# EAGLE design YBDuino (EAGLE 6.5.0)
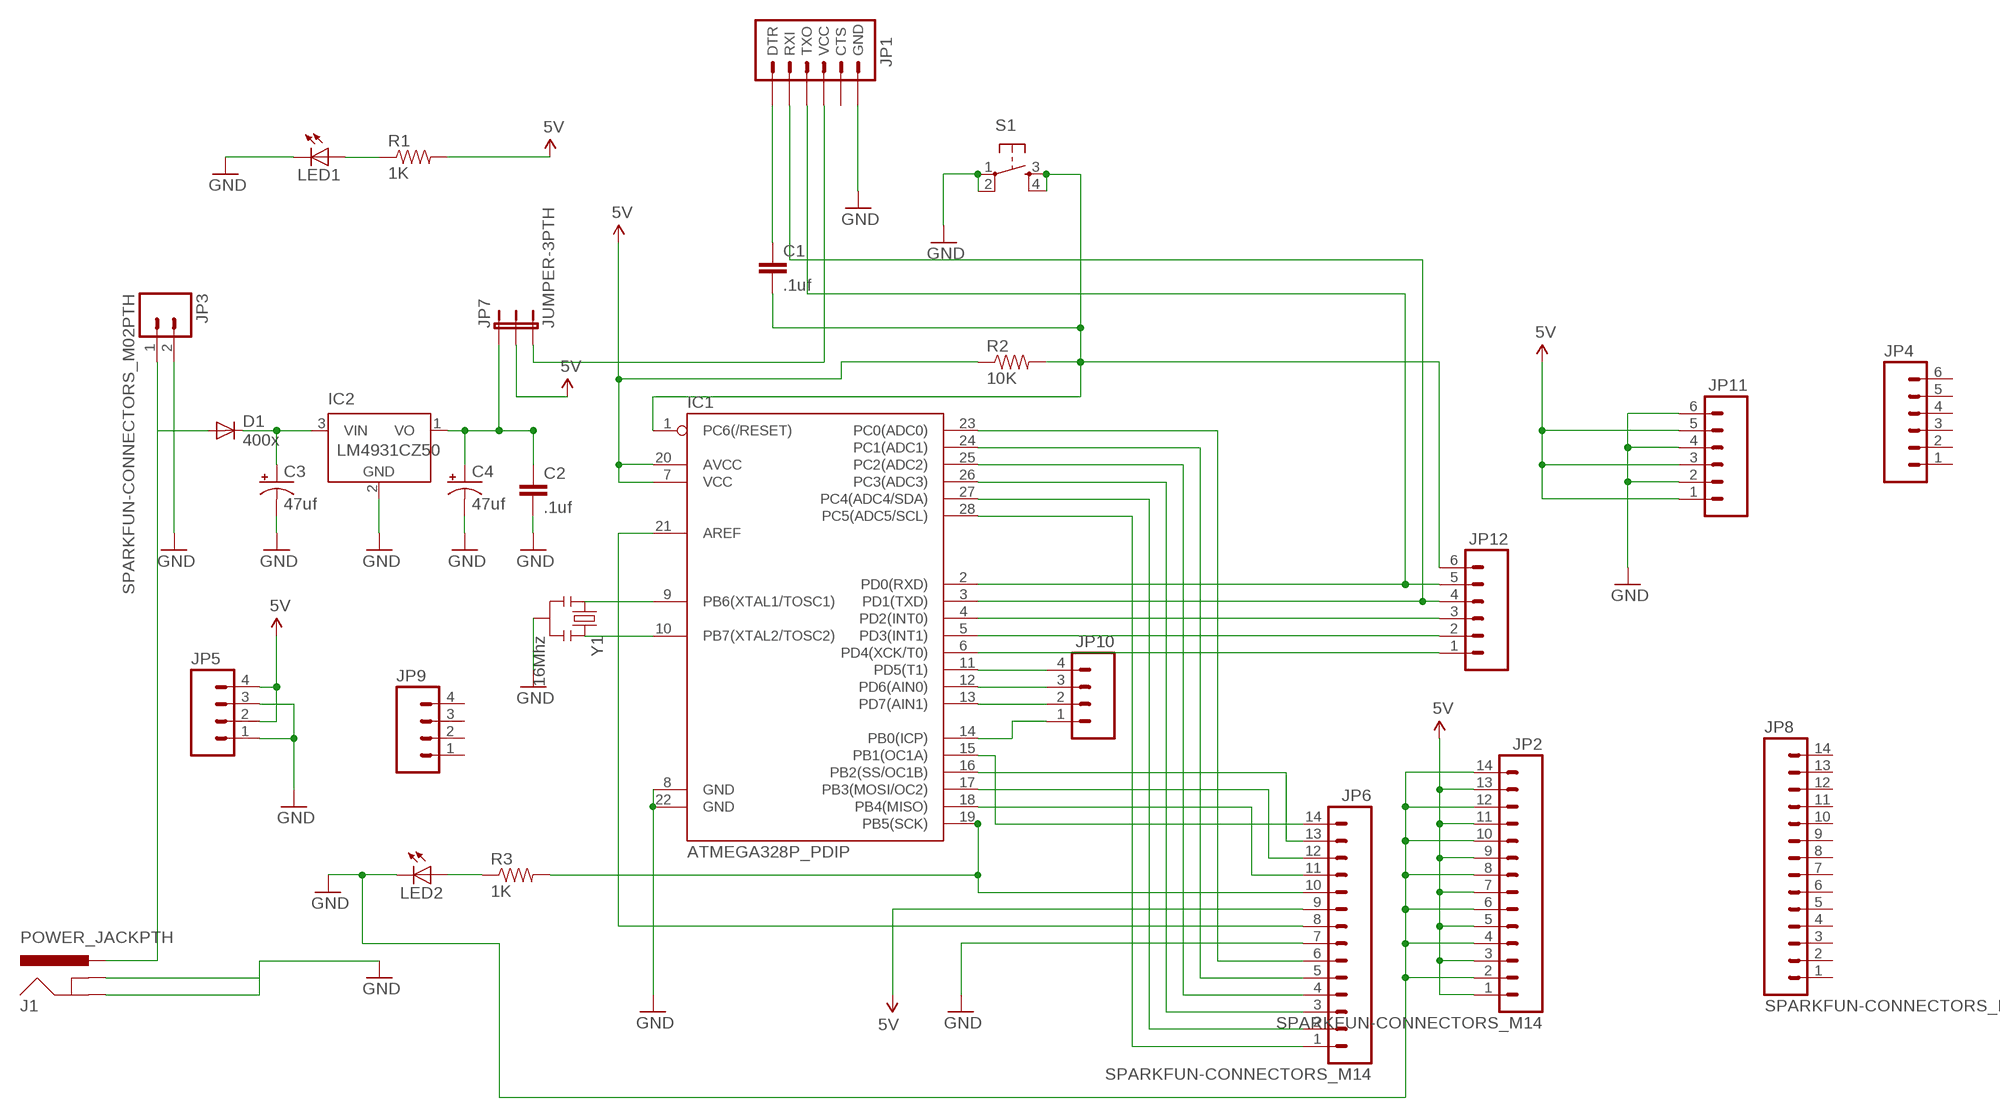
[diagram p0: schematic, sheet 1]

## Parts
C1  .1uf  CAPPTH  [CAP-PTH-SMALL]
C2  .1uf  CAPPTH  [CAP-PTH-SMALL]
C3  47uf  CAP_POLPTH1  [CPOL-RADIAL-100UF-25V]
C4  47uf  CAP_POLPTH1  [CPOL-RADIAL-100UF-25V]
D1  400x  DIODE-C1702-05  [C1702-05]
IC1  ATMEGA328P_PDIP  [DIL28-3]
IC2  LM4931CZ50  LM2936Z-3.0  [TO92]
J1  POWER_JACKPTH  [POWER_JACK_PTH]
JP1  SPARKFUN-CONNECTORS_ARDUINO_SERIAL_PROGRAMPTH-KIT  [SPARKFUN-CONNECTORS_1X06-KIT]
JP2  SPARKFUN-CONNECTORS_M14  [SPARKFUN-CONNECTORS_1X14]
JP3  SPARKFUN-CONNECTORS_M02PTH  [SPARKFUN-CONNECTORS_1X02]
JP4  SPARKFUN-CONNECTORS_M06SIP  [SPARKFUN-CONNECTORS_1X06]
JP5  SPARKFUN-CONNECTORS_M041X04_NO_SILK  [SPARKFUN-CONNECTORS_1X04_NO_SILK]
JP6  SPARKFUN-CONNECTORS_M14  [SPARKFUN-CONNECTORS_1X14]
JP7  JUMPER-3PTH  [1X03]
JP8  SPARKFUN-CONNECTORS_M14  [SPARKFUN-CONNECTORS_1X14]
JP9  SPARKFUN-CONNECTORS_M041X04_NO_SILK  [SPARKFUN-CONNECTORS_1X04_NO_SILK]
JP10  SPARKFUN-CONNECTORS_M041X04_NO_SILK  [SPARKFUN-CONNECTORS_1X04_NO_SILK]
JP11  SPARKFUN-CONNECTORS_M06SIP  [SPARKFUN-CONNECTORS_1X06]
JP12  SPARKFUN-CONNECTORS_M06SIP  [SPARKFUN-CONNECTORS_1X06]
LED1  LED3MM  [LED3MM]
LED2  LED3MM  [LED3MM]
R1  1K  RESISTORPTH-1/4W-VERT  [AXIAL-0.1]
R2  10K  RESISTORPTH-1/4W-VERT  [AXIAL-0.1]
R3  1K  RESISTORPTH-1/4W-VERT  [AXIAL-0.1]
S1  TAC_SWITCHPTH  [TACTILE-PTH]
Y1  16Mhz  RESONATORPTH  [RESONATOR-PTH]

## Nets
5V: IC1.7(VCC) IC1.20(AVCC) JP2.1 JP2.3 JP2.5 JP2.7 JP2.9 JP2.11 JP2.13 JP5.2 JP5.4 JP6.9 JP7.2 JP11.1 JP11.3 JP11.5 R1.P$2 R2.P$1
GND: C2.2 C3.2(-) C4.2(-) IC1.8(GND) IC1.22(GND) IC2.2(GND) J1.GND J1.GNDBREAK JP1.6(GND) JP2.2 JP2.4 JP2.6 JP2.8 JP2.10 JP2.12 JP2.14 JP3.2 JP5.1 JP5.3 JP6.7 JP11.2 JP11.4 JP11.6 LED1.K(C) LED2.K(C) S1.1 S1.2 Y1.2
N$1: IC1.2(PD0(RXD)) JP1.3(TXO) JP12.5
N$2: IC1.3(PD1(TXD)) JP1.2(RXI) JP12.4
N$3: IC1.4(PD2(INT0)) JP12.3
N$4: IC1.5(PD3(INT1)) JP12.2
N$5: IC1.6(PD4(XCK/T0)) JP12.1
N$6: C1.2 IC1.1(PC6(/RESET)) JP12.6 R2.P$2 S1.3 S1.4
N$7: LED1.A R1.P$1
N$8: IC1.11(PD5(T1)) JP10.4
N$9: IC1.12(PD6(AIN0)) JP10.3
N$10: IC1.13(PD7(AIN1)) JP10.2
N$11: IC1.14(PB0(ICP)) JP10.1
N$12: IC1.15(PB1(OC1A)) JP6.14
N$13: IC1.16(PB2(SS/OC1B)) JP6.13
N$14: IC1.17(PB3(MOSI/OC2)) JP6.12
N$15: IC1.18(PB4(MISO)) JP6.11
N$16: IC1.19(PB5(SCK)) JP6.10 R3.P$2
N$17: D1.A J1.PWR JP3.1
N$18: IC1.10(PB7(XTAL2/TOSC2)) Y1.3
N$19: IC1.21(AREF) JP6.8
N$20: IC1.23(PC0(ADC0)) JP6.6
N$21: IC1.24(PC1(ADC1)) JP6.5
N$22: IC1.25(PC2(ADC2)) JP6.4
N$23: IC1.26(PC3(ADC3)) JP6.3
N$24: IC1.9(PB6(XTAL1/TOSC1)) Y1.1
N$25: IC1.28(PC5(ADC5/SCL)) JP6.1
N$26: IC1.27(PC4(ADC4/SDA)) JP6.2
N$28: C3.1(+) D1.C IC2.3(VIN)
N$29: LED2.A R3.P$1
N$30: C1.1 JP1.1(DTR)
N$32: C2.1 C4.1(+) IC2.1(VO) JP7.1
N$33: JP1.4(VCC) JP7.3
Unconnected: JP1.5(CTS) JP4.1 JP4.2 JP4.3 JP4.4 JP4.5 JP4.6 JP8.1 JP8.2 JP8.3 JP8.4 JP8.5 JP8.6 JP8.7 JP8.8 JP8.9 JP8.10 JP8.11 JP8.12 JP8.13 JP8.14 JP9.1 JP9.2 JP9.3 JP9.4

## Library data of the parts
C1 C2 = SparkFun-Capacitors:CAP: Capacitor Standard 0603 ceramic capacitor, and 0.1" leaded capacitor.
C3 C4 = SparkFun-Capacitors:CAP_POL: Capacitor Polarized These are standard SMD and PTH capacitors. Normally 10uF, 47uF, and 100uF in electrolytic and tantalum varieties. Always verify the external diameter of the through hole cap, it varies with capacity, voltage, and manufacturer. The EIA devices should be standard.
D1 = diode:DIODE-: DIODE
IC1 = SparkFun-DigitalIC:ATMEGA328P_PDIP: uC used in the Arduino 32kb flash, 1k EEPROM, 2k SRAM This is the through-hole version of this chip.
IC2 = national-semiconductor:LM2936?*: Ultra-Low Quiescent Current LDO Voltage Regulator Source: Data sheet <http://www.national.com/ds/LM/LM2936.pdf>; MF: NATIONAL SEMICONDUCTOR; MPN: LM2936Z-3.0/NOPB; OC_FARNELL: 1312709; OC_NEWARK: 41K4531
J1 = ybduino:POWER_JACK: Power Jack This is the standard 5.5mm barrel jack for power. The PTH is the most common, proven, reliable, footprint. The Slot footprint only works if the mill layer is transmitted to the PCB fab house so be warned. Mating wall wart : TOL-00298 (and others); PROD_ID: PRT-00119
JP1 = Arduino:SPARKFUN-CONNECTORS_ARDUINO_SERIAL_PROGRAM: FTDI connector footprints
JP2 JP6 JP8 = Arduino:SPARKFUN-CONNECTORS_M14: Header 14 Standard 14-pin 0.1" header. Use with straight break away headers (SKU : PRT-00116), right angle break away headers (PRT-00553), swiss pins (PRT-00743), machine pins (PRT-00117), and female headers (PRT-00115).
JP3 = Arduino:SPARKFUN-CONNECTORS_M02: Standard 2-pin 0.1" header. Use with - straight break away headers ( PRT-00116) - right angle break away headers (PRT-00553) - swiss pins (PRT-00743) - machine pins (PRT-00117) - female headers (PRT-00115) Molex polarized connector foot print use with: PRT-08233 with associated crimp pins and housings. 2.54_SCREWTERM for use with PRT-10571. 3.5mm Screw Terminal footprints for PRT-08084 5mm Screw Terminal footprints for use with PRT-08433
JP4 JP11 JP12 = Arduino:SPARKFUN-CONNECTORS_M06: Header 6 Standard 6-pin 0.1" header. Use with straight break away headers (SKU : PRT-00116), right angle break away headers (PRT-00553), swiss pins (PRT-00743), machine pins (PRT-00117), and female headers (PRT-00115). Molex polarized connector foot print use with SKU : PRT-08094 with associated crimp pins and housings. NOTES ON THE VARIANTS LOCK and LOCK_LONGPADS... This footprint was designed to help hold the alignment of a through-hole component (i.e. 6-pin header) while soldering it into place. You may notice that each hole has been shifted either up or down by 0.005 of an inch from it's more standard position (which is a perfectly straight line). This slight alteration caused the pins (the squares in the middle) to touch the edges of the holes. Because they are alternating, it causes a "brace" to hold the component in place. 0.005 has proven to be the perfect amount of "off-center" position when using our standard breakaway headers. Although looks a little odd when you look at the bare footprint, once you have a header in there, the alteration is very hard to notice. Also,if you push a header all the way into place, it is covered up entirely on the bottom side. This idea of altering the position of holes to aid alignment will be further integrated into the Sparkfun Library for other footprints. It can help hold any component with 3 or more connection pins.
JP5 JP9 JP10 = Arduino:SPARKFUN-CONNECTORS_M04: Header 4 Standard 4-pin 0.1" header. Use with straight break away headers (SKU : PRT-00116), right angle break away headers (PRT-00553), swiss pins (PRT-00743), machine pins (PRT-00117), and female headers (PRT-00115). Molex polarized connector foot print use with SKU : PRT-08231 with associated crimp pins and housings. 1MM SMD Version SKU: PRT-10208
JP7 = SparkFun-Passives:JUMPER-3
LED1 LED2 = SparkFun-LED:LED: LEDs Standard schematic elements and footprints for 5mm, 3mm, 1206, and 0603 sized LEDs. 5mm - Spark Fun Electronics SKU : COM-00529 (and others)
R1-R3 = SparkFun-Resistors:RESISTOR: Resistor Basic schematic elements and footprints for 0603, 1206, and PTH resistors.
S1 = SparkFun-Electromechanical:TAC_SWITCH: Momentary Switch Button commonly used for reset or general input. Spark Fun Electronics SKU : COM-00097 SMT- SWCH-08247
Y1 = SparkFun-FreqCtrl:RESONATOR: Resonator Small SMD resonator. Used, eg, on the Arduino Pro/ Pro Mini boards. 8MHz- XTAL-08895 16MHz- XTAL-08900

## Board
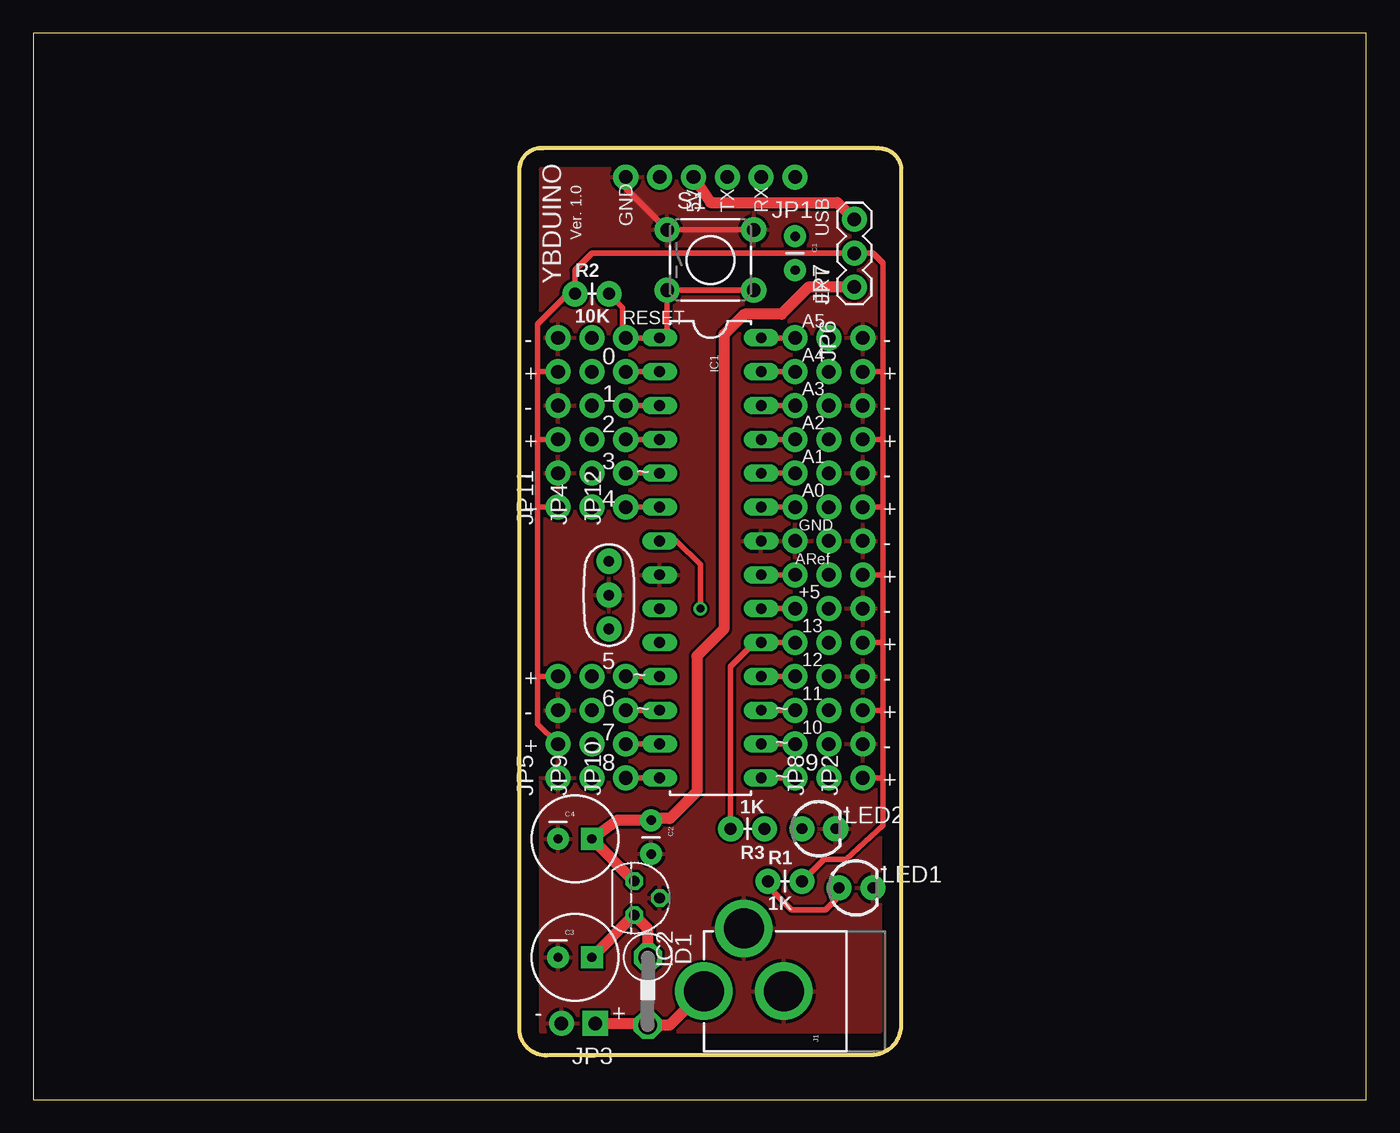
[diagram p1: board, top side]
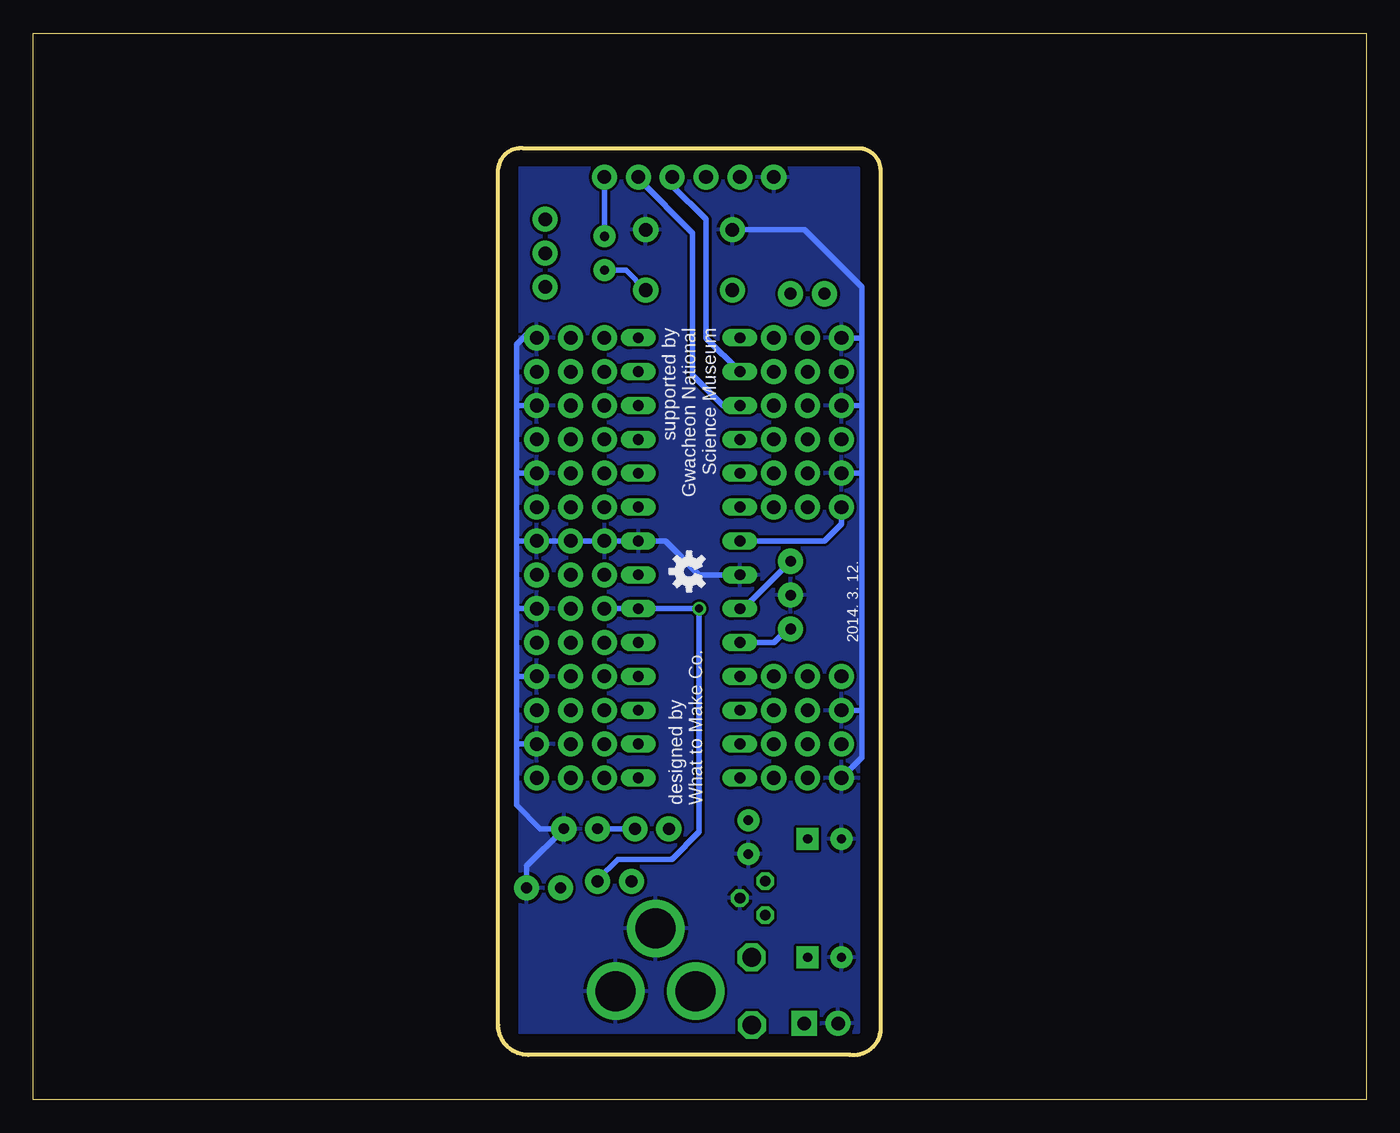
[diagram p2: board, bottom side, seen from below]

Size 100 x 80 mm. Coordinates in mm from the lower left corner, seen from the top.
Outline: 0,0 100,0 100,80 0,80 0,0
Outline: 38.73,3.35 62.87,3.35 arc90 65.13,5.59 65.13,69.85 arc90 63.25,71.37 38.23,71.37 arc90 36.45,69.85 36.45,5.08 arc90 38.73,3.35
Copper layers (1*16): Top 0.035mm / dielectric 1.5mm / Bottom 0.035mm
Design rules "default *": minimum track width 10mil, minimum drill 24mil, track to track 8mil, track to pad 8mil, pad to pad 8mil, via to via 8mil, smd to smd 8mil, copper to edge 40mil, drill to drill 8mil, minimum pad ring 10mil, minimum via ring 8mil, stop-mask expansion 4mil, vias tented up to drill 0mil, thermal gap 10mil

### Footprints (pad centres in the part's own frame; a part is rotated, then mirrored left to right if it is on the bottom)
CAP-PTH-SMALL = drill 0.7 pad 1.651: 1 0,0; 2 2.54,0
CPOL-RADIAL-100UF-25V = drill 0.7 pad 1.651 square: 1 1.27,0 | drill 0.7 pad 1.651: 2 -1.27,0
C1702-05 = drill 1.397 octagon: A 2.54,0; C -2.54,0
DIL28-3 = drill 0.813 long: 1 -16.51,-3.81; 2 -13.97,-3.81; 3 -11.43,-3.81; 4 -8.89,-3.81; 5 -6.35,-3.81; 6 -3.81,-3.81; 7 -1.27,-3.81; 8 1.27,-3.81; 9 3.81,-3.81; 10 6.35,-3.81; 11 8.89,-3.81; 12 11.43,-3.81; 13 13.97,-3.81; 14 16.51,-3.81; 15 16.51,3.81; 16 13.97,3.81; 17 11.43,3.81; 18 8.89,3.81; 19 6.35,3.81; 20 3.81,3.81; 21 1.27,3.81; 22 -1.27,3.81; 23 -3.81,3.81; 24 -6.35,3.81; 25 -8.89,3.81; 26 -11.43,3.81; 27 -13.97,3.81; 28 -16.51,3.81
TO92 = drill 0.813 pad 1.27 octagon: 1 -1.27,0; 2 0,1.905; 3 1.27,0
POWER_JACK_PTH = drill 2.997 pad 4.318: GND 0,7.7; GNDBREAK 4.7,10.7; PWR 0,13.7
SPARKFUN-CONNECTORS_1X06-KIT = drill 1.016 pad 1.88: 1 0,0; 2 2.54,0; 3 5.08,0; 4 7.62,0; 5 10.16,0; 6 12.7,0
SPARKFUN-CONNECTORS_1X14 = drill 1.016 pad 1.88: 1 0,0; 2 2.54,0; 3 5.08,0; 4 7.62,0; 5 10.16,0; 6 12.7,0; 7 15.24,0; 8 17.78,0; 9 20.32,0; 10 22.86,0; 11 25.4,0; 12 27.94,0; 13 30.48,0; 14 33.02,0
SPARKFUN-CONNECTORS_1X02 = drill 1.016 pad 1.88 square: 1 0,0 | drill 1.016 pad 1.88: 2 2.54,0
SPARKFUN-CONNECTORS_1X06 = drill 1.016 pad 1.88: 1 0,0; 2 2.54,0; 3 5.08,0; 4 7.62,0; 5 10.16,0; 6 12.7,0
SPARKFUN-CONNECTORS_1X04_NO_SILK = drill 1.016 pad 1.88: 1 0,0; 2 2.54,0; 3 5.08,0; 4 7.62,0
1X03 = drill 1.016 pad 1.88: 1 0,0; 2 2.54,0; 3 5.08,0
LED3MM = drill 0.813 pad 1.88: A -1.27,0; K 1.27,0
AXIAL-0.1 = drill 0.9 pad 1.88: P$1 0,0; P$2 2.54,0
TACTILE-PTH = drill 1.016 pad 1.88: 1 -3.251,2.261; 2 3.251,2.261; 3 -3.251,-2.261; 4 3.251,-2.261
RESONATOR-PTH = drill 0.8 pad 1.88: 1 -2.54,0; 2 0,0; 3 2.54,0

### Placement (x,y rotation side)
C1  57.15,64.77 270 top
C2  46.35,20.95 270 top
C3  40.64,10.67 0 top
C4  40.64,19.56 0 top
D1  46.1,8.13 269.9 top
IC1  50.8,40.64 270 top
IC2  45.09,15.11 270 top
J1  64.01,8.13 90 top
JP1  57.15,69.22 180 top
JP2  62.23,24.13 90 top
JP3  42.16,5.71 180 top
JP4  41.91,44.45 90 top
JP5  39.37,24.13 90 top
JP6  57.15,57.15 270 top
JP7  61.59,60.96 90 top
JP8  59.69,24.13 90 top
JP9  41.91,24.13 90 top
JP10  44.45,24.13 90 top
JP11  39.37,44.45 90 top
JP12  44.45,44.45 90 top
LED1  61.72,15.88 0 top
LED2  58.93,20.32 0 top
R1  55.12,16.38 0 top
R2  40.64,60.45 0 top
R3  54.86,20.32 180 top
S1  50.8,62.99 0 top
U$1  [OSHW-LOGO-S]  50.8,39.62 90 bottom
Y1  43.18,37.85 270 top

### Tracks (layer width: path | path; a pad name or v marks a point on that pad's centre or on a via)
5V  (via drill 0.6)
  Top 0.406: 63.75,54.61 63.75,62.74 62.99,63.5 JP7.2 41.91,63.5 40.64,62.23 R2.P$1 40.13,60.45 37.85,58.17 37.85,54.61 | 63.75,54.61 63.75,49.53 | 63.75,49.53 63.75,44.45 | 63.75,44.45 63.75,39.37 | 63.75,39.37 63.75,34.29 | 63.75,34.29 63.75,29.21 | 63.75,29.21 63.75,24.13 | 63.75,24.13 63.75,20.57 60.96,18.03 59.31,18.03 R1.P$2 | JP2.13 63.75,54.61 | JP2.1 63.75,24.13 | JP2.3 63.75,29.21 | JP2.5 63.75,34.29 | JP2.7 63.75,39.37 | JP2.9 63.75,44.45 | JP2.11 63.75,49.53 | 37.85,54.61 37.85,49.53 | 37.85,49.53 37.85,44.45 | 37.85,44.45 37.85,31.75 | 37.85,31.75 37.85,28.19 JP5.2 | JP5.4 37.85,31.75 | JP11.5 37.85,54.61 | JP11.3 37.85,49.53 | JP11.1 37.85,44.45 | IC1.20 JP6.9 | v50.04,36.83 50.04,40.13 48.26,41.91 IC1.7
  Bottom 0.406: JP11.1 39.37,43.18 40.64,41.91 IC1.7 | JP6.9 v50.04,36.83 50.04,20.07 52.07,18.03 56.13,18.03 57.66,16.51
GND
  Top 0.406: JP1.6 44.45,68.35 S1.1 S1.2
  Bottom 0.406: LED1.K 62.99,17.53 LED2.K 61.98,20.32 63.75,22.1 63.75,26.67 | 63.75,26.67 63.75,31.75 | 63.75,31.75 63.75,36.83 | 63.75,36.83 63.75,41.91 | 63.75,41.91 63.75,46.99 | 63.75,46.99 63.75,52.07 | 63.75,52.07 63.75,56.64 62.99,57.4 62.48,57.4 JP2.14 | JP2.12 63.75,52.07 | JP2.10 63.75,46.99 | 63.75,41.91 JP2.8 IC1.22 52.58,41.91 50.04,39.37 IC1.8 | JP2.6 63.75,36.83 | JP2.4 63.75,31.75 | JP2.2 63.75,26.67 | S1.1 42.14,65.25 37.85,60.96 37.85,57.15 | 37.85,57.15 37.85,52.07 | 37.85,52.07 37.85,46.99 | 37.85,46.99 37.85,29.21 | 37.85,29.21 37.85,25.65 JP5.1 | JP11.6 37.85,57.15 | JP11.4 37.85,52.07 | JP11.2 37.85,46.99 | JP5.3 37.85,29.21
  pour Top: 38.1,69.85 63.5,69.85 63.5,5.08 38.1,5.08
  pour Bottom: 38.1,69.85 63.5,69.85 63.5,5.08 38.1,5.08
N$1
  Top 0.406: JP12.5 IC1.2
  Bottom 0.406: JP1.3 52.07,68.58 49.53,66.04 49.53,57.15 IC1.2
N$2
  Top 0.406: IC1.3 JP12.4
  Bottom 0.406: JP1.2 54.61,69.09 50.55,65.02 50.55,54.36 48.26,52.07 IC1.3
N$3
  Top 0.406: JP12.3 IC1.4
N$4
  Top 0.406: JP12.2 IC1.5
N$5
  Top 0.406: IC1.6 JP12.1
N$6
  Top 0.406: S1.4 S1.3 47.55,57.71 IC1.1 JP12.6 44.2,57.4 44.2,59.44 R2.P$2
  Bottom 0.406: C1.2 55.55,62.23 S1.4
N$7
  Top 0.406: R1.P$1 55.12,16 56.9,14.22 59.44,14.22 60.45,15.24 LED1.A
N$8
  Top 0.406: JP10.4 IC1.11
N$9
  Top 0.406: IC1.12 JP10.3
N$10
  Top 0.406: IC1.13 JP10.2
N$11
  Top 0.406: IC1.14 JP10.1
N$12
  Top 0.406: IC1.15 JP6.14
N$13
  Top 0.406: IC1.16 JP6.13
N$14
  Top 0.406: IC1.17 JP6.12
N$15
  Top 0.406: IC1.18 JP6.11
N$16
  Top 0.406: IC1.19 JP6.10 54.1,34.29 52.32,32.51 R3.P$2
N$17
  Top 0.813: JP3.1 45.97,5.71 D1.A 47.77,5.59 J1.PWR
N$18
  Bottom 0.406: Y1.3 43.43,35.31 44.45,34.29 IC1.10
N$19
  Top 0.406: IC1.21 JP6.8
N$20
  Top 0.406: IC1.23 JP6.6
N$21
  Top 0.406: IC1.24 JP6.5
N$22
  Top 0.406: IC1.25 JP6.4
N$23
  Top 0.406: IC1.26 JP6.3
N$24
  Bottom 0.406: IC1.9 46.74,36.83 Y1.1
N$25
  Top 0.406: IC1.28 JP6.1
N$26
  Top 0.406: JP6.2 IC1.27
N$28
  Top 0.813: C3.1 IC2.3 46.1,12.82 D1.C
N$29
  Bottom 0.406: R3.P$1 LED2.A
N$30
  Bottom 0.406: JP1.1 C1.1
N$32
  Top 0.813: JP7.1 58.17,60.96 56.13,58.93 53.34,58.93 51.82,57.4 51.82,35.31 49.78,33.27 49.78,23.11 47.75,21.08 46.48,21.08 C2.1 43.81,20.95 C4.1 IC2.1
N$33
  Top 0.813: JP1.4 50.8,67.31 60.33,67.31 JP7.3

### Text on the board
tPlace: 5V | TX | RX | GND | Ver. 1.0 | USB | YBDUINO | EXT | RESET | A5 | - | - | 0 | A4 | + | + | A3 | 1 | - | - | 2 | A2 | + | + | A1 | 3 | - | ~ | - | A0 | + | 4 | + | GND | - | ARef | + | +5 | - | 13 | + | 12 | 5 | + | ~ | - | 11 | 6 | ~ | ~ | - | + | 7 | 10 | + | ~ | - | 8 | 9 | ~ | - | + | - | - | - | +
bPlace: supported by / Gwacheon National / Science Museum | 2014. 3. 12. | designed by / What to Make Co.